# EAGLE design Itsy Bitsy 32u4 5V (EAGLE 6.4)
COMPANY: ADAFRUIT INDUSTRIES; DRAWN: KTOWN; REV: B
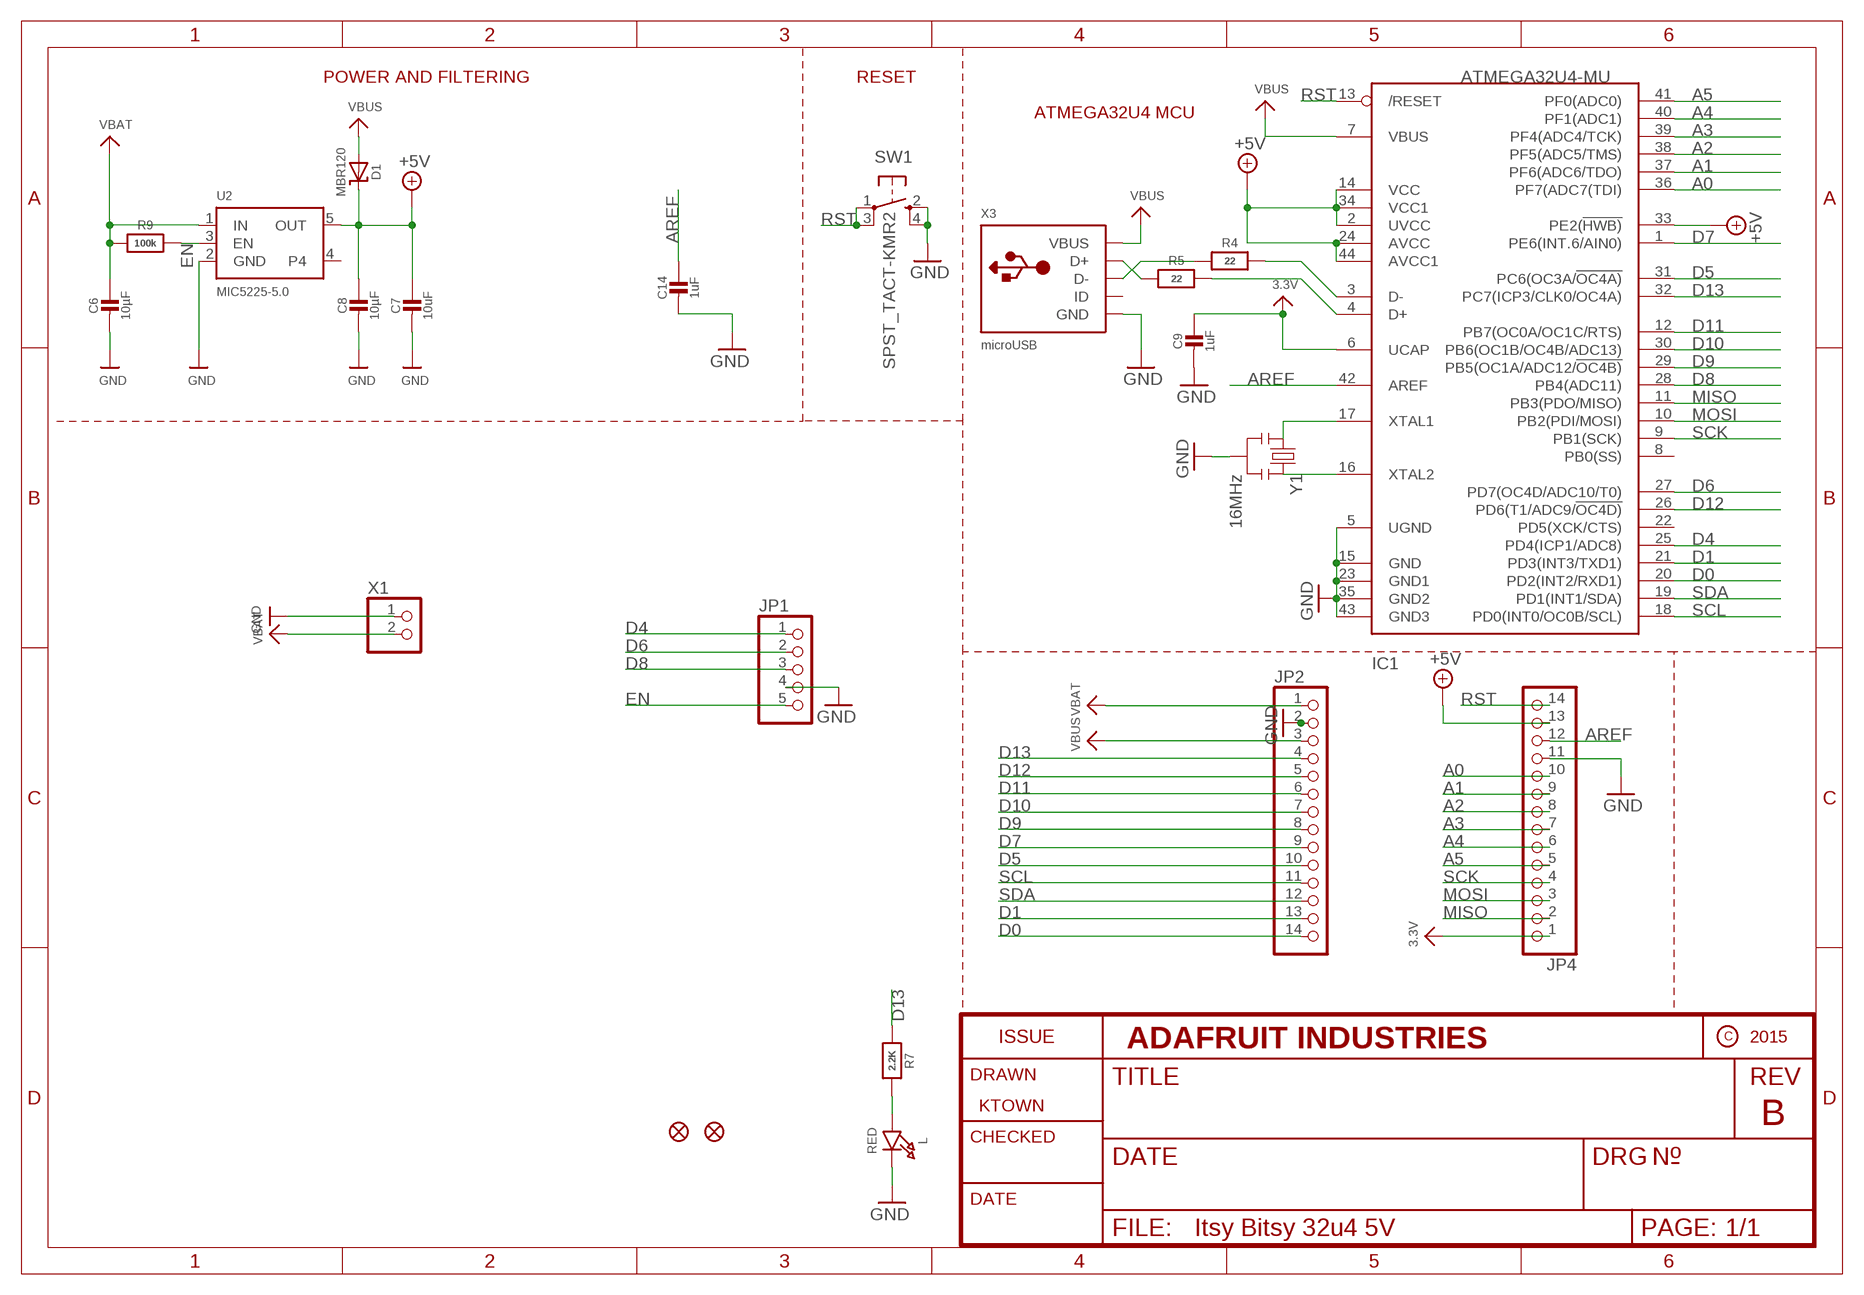
[diagram p0: schematic, sheet 1]

## Parts
C6  10µF  CAP_CERAMIC0805-NOOUTLINE  [0805-NO]
C7  10uF  CAP_CERAMIC0805-NOOUTLINE  [0805-NO]
C8  10µF  CAP_CERAMIC0805-NOOUTLINE  [0805-NO]
C9  1uF  CAP_CERAMIC0603_NO  [0603-NO]
C14  1uF  CAP_CERAMIC0603_NO  [0603-NO]
D1  MBR120  DIODE-SCHOTTKYSOD-123  [SOD-123]
IC1  ATMEGA32U4-MU  [TQFN44_7MM]
JP1  HEADER-1X5ROUND  [1X05_ROUND]
JP2  HEADER-1X14  [1X14_ROUND70]
JP4  HEADER-1X14  [1X14_ROUND70]
L  RED  LED0805_NOOUTLINE  [CHIPLED_0805_NOOUTLINE]
R4  22  RESISTOR_0603_NOOUT  [0603-NO]
R5  22  RESISTOR_0603_NOOUT  [0603-NO]
R7  2.2K  RESISTOR_0603_NOOUT  [0603-NO]
R9  100k  RESISTOR_0603_NOOUT  [0603-NO]
SW1  SPST_TACT-KMR2  [KMR2]
U2  MIC5225-5.0  VREG_SOT23-5  [SOT23-5]
U$34  FIDUCIAL""  [FIDUCIAL_1MM]
U$35  FIDUCIAL""  [FIDUCIAL_1MM]
X1  CON_JST_PH_2PIN  [JSTPH2]
X3  microUSB  USB_MICRO_20329_V2  [4UCONN_20329_V2]
Y1  16MHz  RESONATORSMD  [RESONATOR-SMD]

## Nets
3.3V: C9.1 IC1.6(UCAP) JP4.1
+5V: C7.1 C8.1 D1.C IC1.2(UVCC) IC1.14(VCC) IC1.24(AVCC) IC1.33(PE2(!HWB)) IC1.34(VCC1) IC1.44(AVCC1) JP4.13 U2.5(OUT)
A0: IC1.36(PF7(ADC7(TDI)) JP4.10
A1: IC1.37(PF6(ADC6/TDO)) JP4.9
A2: IC1.38(PF5(ADC5/TMS)) JP4.8
A3: IC1.39(PF4(ADC4/TCK)) JP4.7
A4: IC1.40(PF1(ADC1)) JP4.6
A5: IC1.41(PF0(ADC0)) JP4.5
AREF: C14.1 IC1.42(AREF) JP4.12
D0: IC1.20(PD2(INT2/RXD1)) JP2.14
D1: IC1.21(PD3(INT3/TXD1)) JP2.13
D4: IC1.25(PD4(ICP1/ADC8)) JP1.1
D5: IC1.31(PC6(OC3A/!OC4A)) JP2.10
D6: IC1.27(PD7(OC4D/ADC10/T0)) JP1.2
D7: IC1.1(PE6(INT.6/AIN0)) JP2.9
D8: IC1.28(PB4(ADC11)) JP1.3
D9: IC1.29(PB5(OC1A/ADC12/!OC4B)) JP2.8
D10: IC1.30(PB6(OC1B/OC4B/ADC13)) JP2.7
D11: IC1.12(PB7(OC0A/OC1C/RTS)) JP2.6
D12: IC1.26(PD6(T1/ADC9/!OC4D)) JP2.5
D13: IC1.32(PC7(ICP3/CLK0/OC4A)) JP2.4 R7.1
D+: IC1.4(D+) R5.2
D-: IC1.3(D-) R4.2
EN: JP1.5 R9.2 U2.3(EN)
GND: C6.2 C7.2 C8.2 C9.2 C14.2 IC1.5(UGND) IC1.15(GND) IC1.23(GND1) IC1.35(GND2) IC1.43(GND3) JP1.4 JP2.2 JP4.11 L.C SW1.2(S) SW1.4(S1) U2.2(GND) X1.1 X3.BASE@1(GND) X3.BASE@2(GND) X3.GND X3.SPRT@1(GND) X3.SPRT@2(GND) X3.SPRT@3(GND) X3.SPRT@4(GND) Y1.2
MISO: IC1.11(PB3(PDO/MISO)) JP4.2
MOSI: IC1.10(PB2(PDI/MOSI)) JP4.3
N$2: L.A R7.2
N$11: IC1.16(XTAL2) Y1.3
N$12: IC1.17(XTAL1) Y1.1
N$15: R5.1 X3.D+
N$16: R4.1 X3.D-
RST: IC1.13(/RESET) JP4.14 SW1.1(P) SW1.3(P1)
SCK: IC1.9(PB1(SCK)) JP4.4
SCL: IC1.18(PD0(INT0/OC0B/SCL)) JP2.11
SDA: IC1.19(PD1(INT1/SDA)) JP2.12
VBAT: C6.1 JP2.1 R9.1 U2.1(IN) X1.2
VBUS: D1.A IC1.7(VBUS) JP2.3 X3.VBUS
Unconnected: IC1.8(PB0(SS)) IC1.22(PD5(XCK/CTS)) U2.4 X3.ID

## Notes on the sheet
- POWER AND FILTERING | RESET
- ATMEGA32U4 MCU

## Library data of the parts
C6-C9 C14 = microbuilder:CAP_CERAMIC: Ceramic Capacitors For new designs, use the packages preceded by an '_' character since they are more reliable: The following footprints should be used on most boards: _0402 - Standard footprint for regular board layouts _0603 - Standard footprint for regular board layouts _0805 - Standard footprint for regular board layouts _1206 - Standard footprint for regular board layouts For extremely tight-pitch boards where space is at a premium, the following 'micro-pitch' footprints can be used (smaller pads, no silkscreen outline, etc.): _0402MP - Micro-pitch footprint for very dense/compact boards _0603MP - Micro-pitch footprint for very dense/compact boards _0805MP - Micro-pitch footprint for very dense/compact boards _1206MP - Micro-pitch footprint for very dense/compact boards
D1 = microbuilder:DIODE-SCHOTTKY
IC1 = microbuilder:ATMEGA32U4: http://www.ladyada.net/library/eagle
JP1 = microbuilder:HEADER-1X5: PIN HEADER
JP2 JP4 = microbuilder:HEADER-1X14
L = microbuilder:LED: LED 0603 - 0603 Surface Mount Package 2mA: Green LED - Low Power (3.9mcd, 2ma, 1.7Vf) - Digikey: 475-2709-2-ND Orange LED - Low Power (9.8mcd, 2ma, 1.8Vf) - Digikey: 475-1194-2-ND Red LED - Low Power (5mcd, 2ma, 1.8Vf) - Digikey: 475-1195-2-ND Yellow LED - Low Power (7mcd, 2ma, 1.8Vf) - Digikey: 475-1196-2-ND 5mA: Blue LED - Low Power (17mcd, 5ma, 2.9Vf) - Digikey: LNJ937W8CRACT-ND 0805 - 0805 Surface Mount Package 2mA: Red LED (8.8mcd, 2mA, 1.8Vf, Clear) - Low Power [Digikey: 475-2510-1-ND] Green LED (5mcd, 2mA, 1.8Vf, Clear) - Low Power [Digikey: 475-2730-1-ND] Yellow LED (11.3mcd, 2mA, 1.8Vf, Clear) - Low Power [Digikey: 475-2555-1-ND] 20mA: Red LED (104mcd, 20mA, Diffused) - LS R976 [Digikey: 475-1278-6-ND] Red LED (12mcd, 20mA, 2.0Vf, Clear) - APT2012EC [Digikey: 754-1128-1-ND] Green LED (15mcd, 20mA, 2.2Vf, Clear) - APT2012GC [Digikey: 754-1131-1-ND] Orange LED (160mcd, 20mA, 2.1Vf, Clear) - APT2012SECK [Digikey: 754-1130-1-ND] 1206 - 1206 Surface Mount Package Green LED (26mcd, 20mA, Diffused) - LG N971 [Digikey: 475-1407-6-ND] Red LED (15mcd, 20mA, Diffused) - LH N974 [Digikey: 475-1416-6-ND] Cree - Cree High-Power Surface Mount LEDs XPEBWT-L1-0000-00D50 - White 111lm 350mA 2.9Vf 6200K 110° XTEAWT-00-0000-00000LEE3 - White 114lm 350mA 2.85Vf 5000K 115° Everlight - Everlight 45-21 Series Surface Mount LEDs 45-21/QK2C-B2832AC2CB2/2T - Warm White 2000mcd 20mA 3.25Vf 3050K 120° 45-21/LK2C-B38452C4CB2/2T - Nuetral White 2000mcd 20mA 3.25Vf 4150K 120° 45-21/LK2C-B50634C6CB2/2T - Cold White 2200mcd 20mA 3.25Vf 5650K 120° PLCC2 Reverse Mount LS T77K-J1L2-1-0-2-R18-Z - Red 11.25mcd 2mA 1.8Vf 630nm 120° LO T77K-L1M2-24-Z - Orange 19.6mcd 2mA 1.8Vf 606nm 120° LY T77K-K2M1-26-Z - Yellow 15.7mcd 2mA 1.8Vf 587nm 120°
R4 R5 R7 R9 = microbuilder:RESISTOR: Resistors For new designs, use the packages preceded by an '_' character since they are more reliable: The following footprints should be used on most boards: _0402 - Standard footprint for regular board layouts _0603 - Standard footprint for regular board layouts _0805 - Standard footprint for regular board layouts _1206 - Standard footprint for regular board layouts For extremely tight-pitch boards where space is at a premium, the following 'micro-pitch' footprints can be used (smaller pads, no silkscreen outline, etc.): _0402MP - Micro-pitch footprint for very dense/compact boards _0603MP - Micro-pitch footprint for very dense/compact boards _0805MP - Micro-pitch footprint for very dense/compact boards _1206MP - Micro-pitch footprint for very dense/compact boards
SW1 = adafruit:SPST_TACT: SMT 6mm switch, EVQQ2 series http://www.ladyada.net/library/eagle
U2 = microbuilder:VREG_SOT23-5: SOT23-5 Fixed Voltage Regulators Part Current Out V Out V In V Dropout θJA (°C/W) TJ (°C) Digikey Part No. ADP121 150mA 3.3V 3.4-5.5V 0.09V @ 150mA -- -- ADP121-AUJZ33R7CT-ND ADP121 150mA 3.0V 3.1-5.5V 0.09V @ 150mA -- -- ADP121-AUJZ30R7CT-ND ADP122 300mA 3.3V 3.4-5.5V 0.085V @ 300mA -- -- ADP122AUJZ-3.3-R7CT-ND ADP1712 300mA 3.3V 3.5-5.5V 0.17V @ 300mA -- -- ADP1712AUJZ-3.3-R7TR-ND AP7311 (Low Cost) 150mA 3.3V 3.5-6V 0.15V @ 150mA -- -- AP7311-33WG-7DICT-ND LD39015M18R 150mA 1.8V 1.9V-5.5V 0.08V @ 100mA -- -- 497-6977-1-ND LP2985A-33DBVR 150mA 3.3V 3.3-16V 0.28V @ 150mA 206 150 296-18479-1-ND MCP1824T-3302E/OT 300mA 3.3V 3.5V-6V 0.2V @ 300mA -- -- MCP1824T-3302E/OTCT-ND MIC5205-2.5YM5 TR 150mA 2.5V 2.7-16V 0.165V @ 150mA -- -- 576-1257-2-ND MIC5205-3.0YM5 TR 150mA 3.0V 3.2V-16V 0.165V @ 150mA -- -- 576-1258-2-ND MIC5205-3.3YM5 TR 150mA 3.3V 3.5V-16V 0.165V @ 150mA -- -- 576-1259-2-ND TPS780330220 150mA 3.3V+2.2V 3.6-5.5V 250mV Max -- -- 296-23332-1-ND TDA3663/N1,135 100mA 3.3V 3.5-45V 0.18V @ 50mA -- -- 568-5343-1-ND Max operating temp can be calculated using θJA, TJ (max junction temperature), and power in watts. Set the "Maximum Ambient Temperature" until it reaches TJ ("Max Junction Temperature"), which is the absolute limit for safe use of the regulator: Heat Sink Temperature Calculator <http://www.daycounter.com/Calculators/Heat-Sink-Temperature-Calculator.phtml> For example, With 12V source into a 3.3V LP2985 and a 30mA load, we are dissipating (12V-3.3V) * 0.03A = 0.261W. With a θJA of 206 °C/W, a TJ of 150°C, and 261mW we can safely use the chip without a heat sink up to 75°C (=147.1°C Junction Temperature).
U$34 U$35 = microbuilder:FIDUCIAL: Fiducial Alignment Points Various fiducial points for machine vision alignment.; BOM: EXCLUDE
X1 = microbuilder:CON_JST_PH_2PIN: JST 2-Pin Right-Angle Connector PH-Series - 4UConnector: 17311 SH-Series - 4UConnector: 07278
X3 = microbuilder:USB: USB Connectors USBMINIB - Surface Mount Female Mini-B USB Connector 4UConnector: 06564
Y1 = SparkFun:RESONATOR: Resonator Small SMD resonator. This is the itty bitty 10/20MHz resonators with built in caps. CSTCE10M0G55 and CSTCE20M0V53. Footprint has been reviewed closely but hasn't been tested yet.

## Board
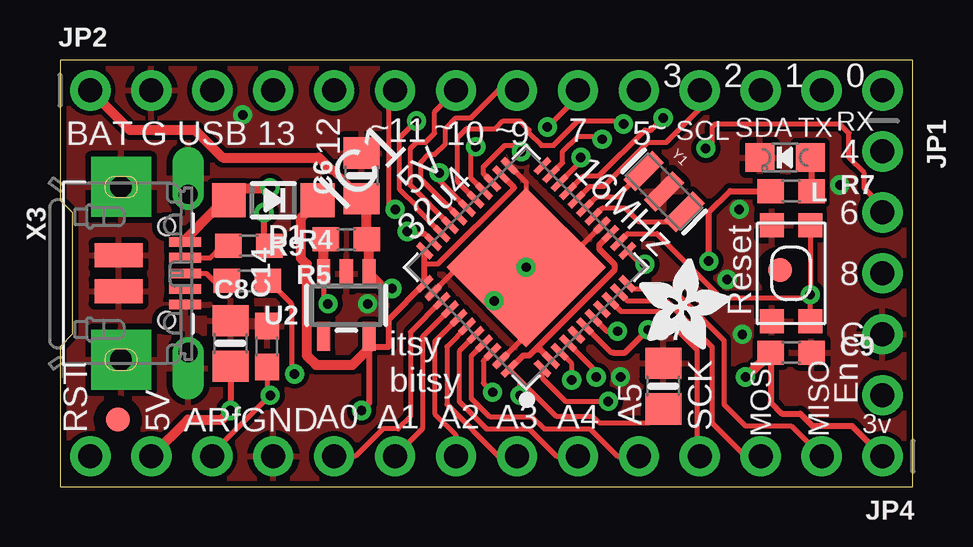
[diagram p1: board, top side]
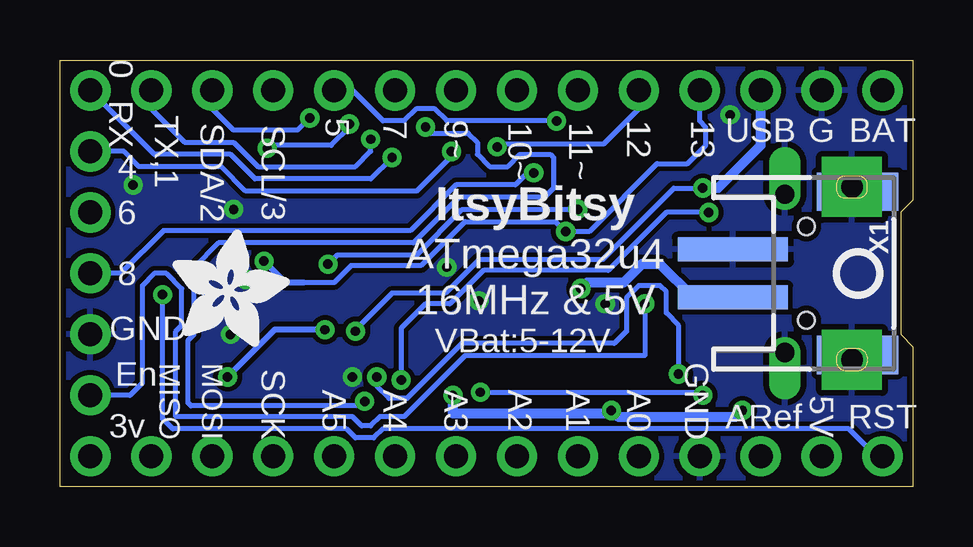
[diagram p2: board, bottom side, seen from below]

Size 35.56 x 17.78 mm. Coordinates in mm from the lower left corner, seen from the top.
Outline: 0,5.84 0,0 35.56,0 35.56,17.78 0,17.78 0,11.94 0.51,11.43 0.51,6.35 0,5.84
Copper layers (1*16): Top 0.035mm / dielectric 1.5mm / Bottom 0.035mm
Design rules "adafruit *": minimum track width 8mil, minimum drill 15.5mil, track to track 8mil, track to pad 8mil, pad to pad 8mil, via to via 8mil, smd to smd 8mil, copper to edge 10mil, drill to drill 8mil, minimum pad ring 10mil, minimum via ring 8mil, stop-mask expansion 2mil, vias tented up to drill 20mil, thermal gap 10mil

### Footprints (pad centres in the part's own frame; a part is rotated, then mirrored left to right if it is on the bottom)
0805-NO = smd 1.3 x 1.5: 1 -0.95,0; 2 0.95,0
0603-NO = smd 1.1 x 1: 1 -0.85,0; 2 0.85,0
SOD-123 = smd 1.4 x 1.4: A 1.85,0; C -1.85,0
TQFN44_7MM = smd 0.25 x 0.8: 1 -2.5,-3.475; 2 -2,-3.475; 3 -1.5,-3.475; 4 -1,-3.475; 5 -0.5,-3.475; 6 0,-3.475; 7 0.5,-3.475; 8 1,-3.475; 9 1.5,-3.475; 10 2,-3.475; 11 2.5,-3.475; 23 2.5,3.475; 24 2,3.475; 25 1.5,3.475; 26 1,3.475; 27 0.5,3.475; 28 0,3.475; 29 -0.5,3.475; 30 -1,3.475; 31 -1.5,3.475; 32 -2,3.475; 33 -2.5,3.475 | smd 0.8 x 0.25: 12 3.475,-2.5; 13 3.475,-2; 14 3.475,-1.5; 15 3.475,-1; 16 3.475,-0.5; 17 3.475,0; 18 3.475,0.5; 19 3.475,1; 20 3.475,1.5; 21 3.475,2; 22 3.475,2.5; 34 -3.475,2.5; 35 -3.475,2; 36 -3.475,1.5; 37 -3.475,1; 38 -3.475,0.5; 39 -3.475,0; 40 -3.475,-0.5; 41 -3.475,-1; 42 -3.475,-1.5; 43 -3.475,-2; 44 -3.475,-2.5 | smd 4.7 x 4.7: THERMAL 0,0
1X05_ROUND = drill 1 pad 1.676: 1 -5.08,0; 2 -2.54,0; 3 0,0; 4 2.54,0; 5 5.08,0
1X14_ROUND70 = drill 1 pad 1.676: 1 -16.51,0; 2 -13.97,0; 3 -11.43,0; 4 -8.89,0; 5 -6.35,0; 6 -3.81,0; 7 -1.27,0; 8 1.27,0; 9 3.81,0; 10 6.35,0; 11 8.89,0; 12 11.43,0; 13 13.97,0; 14 16.51,0
CHIPLED_0805_NOOUTLINE = smd 1.2 x 1.2: A 0,-1.05; C 0,1.05
KMR2 = smd 1 x 1: 1 2,0.8; 2 2,-0.8; 3 -2,0.8; 4 -2,-0.8
SOT23-5 = smd 0.55 x 1.2: 1 -0.95,-1.3; 2 0,-1.3; 3 0.95,-1.3; 4 0.95,1.3; 5 -0.95,1.3
FIDUCIAL_1MM = smd 1 x 1: 1 0,0
JSTPH2 = smd 1 x 4.6: 1 -1,-3.7; 2 1,-3.7 | smd 1.6 x 3.4: NC1 -3.4,1.5; NC2 3.4,1.5
4UCONN_20329_V2 = smd 1 x 2: BASE@1 -0.75,-2; BASE@2 0.75,-2 | smd 0.4 x 1.35: D+ 0,0.775; D- -0.65,0.775; GND 1.3,0.775; ID 0.65,0.775; VBUS -1.3,0.775 | drill 0.8 pad 1.2 offset: SPRT@1 -3.3,0.9; SPRT@2 3.3,0.9 | drill 0.9 pad 2.5 square: SPRT@3 -3.6,-1.9; SPRT@4 3.6,-1.9 | hole 0.7: -1.95,0; 1.95,0
RESONATOR-SMD = smd 0.7 x 1.7: 1 -1.2,0; 2 0,0; 3 1.2,0

### Placement (x,y rotation side)
C6  12.57,12.95 90 top
C7  25.15,4.19 90 top
C8  7.11,5.97 90 top
C9  30.48,5.59 0 top
C14  8.64,5.84 90 top
D1  8.89,11.94 180 top
IC1  19.43,9.14 45 top
JP1  34.29,8.89 270 top
JP2  17.78,16.51 0 top
JP4  17.78,1.27 180 top
L  30.23,13.72 90 top
R4  7.87,10.03 0 top
R5  7.81,8.57 0 top
R7  30.48,12.32 0 top
R9  11.94,10.31 180 top
SW1  30.48,8.89 270 top
U2  11.94,7.57 180 top
U$4  [ADAFRUIT_5MM]  30.86,5.84 0 bottom
U$7  [ADAFRUIT_3.5MM]  24.13,5.71 0 top
U$10  [PCBFEAT-REV-040]  2.29,8.89 0 bottom
U$34  2.41,2.79 270 top
U$35  30.02,9.02 270 top
X1  3.81,8.89 270 bottom
X3  4.45,8.89 270 top
Y1  25.18,12.3 315 top

### Tracks (layer width: path | path; a pad name or v marks a point on that pad's centre or on a via)
3.3V  (via drill 0.39)
  Top 0.203: IC1.6 22.99,5.59 23.07,5.59
  Top 0.254: 23.07,5.59 23.56,5.59 v24.51,6.54 | C9.1 29.63,3.52 30.1,3.05 30.86,3.05 31.37,2.54 33.02,2.54 JP4.1
  Top 0.406: C9.1 28.61,4.57 v28.57,4.57
  Bottom 0.254: v24.51,6.54 26.61,6.54 v28.57,4.57
+5V  (via drill 0.39)
  Top 0.203: 19.18,4.45 20.7,2.92 22.23,2.92 22.48,2.67 24.57,2.67 C7.1 | 19.18,4.45 18.74,4.88 | v19.18,3.81 19.18,4.45 | 18.92,12.45 15.75,9.27 15.21,9.27
  Top 0.254: IC1.33 15.21,9.27 15.21,8.47 | 15.21,8.47 IC1.34 | IC1.24 18.92,12.48 18.92,12.45 | v12.57,3.17 12.89,3.49 U2.5 13.02,6.27 13.02,5.84 13.72,5.84 13.72,6.99 15.21,8.47 | C8.1 v7.11,3.17 | 18.74,4.88 IC1.44 18.76,4.92 19.3,5.46 19.56,5.46 19.81,5.71 | IC1.2 20.03,5.71 19.81,5.71 | IC1.14 22.48,10.07 22.48,9.91 23.11,9.27 23.11,9.02 19.81,5.71
  Top 0.406: JP4.13 5.33,2.79 6.73,2.79 v7.11,3.17 | D1.C 10.74,11.88 10.03,11.18 10.03,9.53 10.29,9.27 10.29,5.46 10.67,5.08 12.19,5.08 12.89,5.78 U2.5
  Bottom 0.406: v12.57,3.17 12.45,3.05 | 12.45,3.05 12.32,2.92 7.37,2.92 v7.11,3.17 | 12.45,3.05 19.18,3.05 v19.18,3.81
A0
  Top 0.203: IC1.36 14.61,6.44 14.61,2.92 14.1,2.41 13.46,2.41 12.32,1.27 JP4.10
A1
  Top 0.203: IC1.37 15.11,6.24 15.11,2.41 JP4.9
A2
  Top 0.203: JP4.8 16.51,2.16 15.62,3.05 15.62,6.04 IC1.38
A3
  Top 0.203: JP4.7 18.29,1.27 16.13,3.43 16.13,5.84 IC1.39
A4
  Top 0.203: IC1.40 16.64,5.64 16.64,3.56 17.78,2.41 19.56,2.41 20.7,1.27 JP4.6
A5
  Top 0.203: IC1.41 17.14,5.44 17.14,3.68 17.91,2.92 19.68,2.92 20.19,2.41 22.1,2.41 23.24,1.27 JP4.5
AREF  (via drill 0.39)
  Top 0.203: IC1.42 17.65,5.25 17.65,4.32 v18.03,3.94 | JP4.12 6.35,1.4 v8.76,3.81 8.64,3.94 C14.1
  Bottom 0.203: v18.03,3.94 8.89,3.94 v8.76,3.81
D0  (via drill 0.39)
  Top 0.203: IC1.20 21.72,13.55 v21.72,13.72
  Bottom 0.203: JP2.14 31.62,13.84 28.45,13.84 27.43,12.83 22.61,12.83 v21.72,13.72
D1  (via drill 0.39)
  Top 0.203: IC1.21 20.95,13.5 20.95,13.97 21.59,14.61 22.61,14.61 v22.61,14.48
  Bottom 0.203: JP2.13 31.75,15.75 30.35,14.35 28.32,14.35 27.3,13.34 23.24,13.34 22.61,13.97 v22.61,14.48
D4  (via drill 0.39)
  Top 0.203: IC1.25 17.65,13.04 17.65,13.34 18.54,14.22 18.99,14.22 v19.24,13.97
  Bottom 0.203: JP1.1 32.89,13.97 32.26,13.34 28.83,13.34 27.81,12.32 20.7,12.32 19.24,13.78 v19.24,13.97
D5  (via drill 0.39)
  Top 0.203: IC1.31 14.86,11.6 14.86,11.68 14.16,12.38 14.16,14.54 v14.86,15.24
  Bottom 0.203: v14.86,15.24 19.43,15.24 19.94,15.75 20.7,15.75 21.21,15.24 22.1,15.24 23.37,16.51
  Bottom 0.254: 23.37,16.51 JP2.10
D6  (via drill 0.39)
  Top 0.203: IC1.27 16.57,12.71 16.57,14.54 16.95,14.92 18.16,14.92 18.48,15.24 19.18,15.24 19.56,14.86 19.56,14.73 20.07,14.22 20.57,14.22 21.59,15.24 23.37,15.24 v23.5,15.11 | v26.92,14.1 27.18,14.35 27.18,14.99 27.3,15.11 32.51,15.11 32.89,14.73 32.89,13.72 33.53,13.08 33.53,12.45 34.29,11.68 JP1.2
  Bottom 0.203: v23.5,15.11 23.5,14.99 24.26,14.22 26.8,14.22 | 26.8,14.22 26.92,14.22 | v26.92,14.1 26.8,14.22
D7  (via drill 0.39)
  Top 0.203: v22.86,3.56 21.08,3.56 20.12,4.52 IC1.1 | JP2.9 21.59,16.13 21.46,16.13 v20.32,14.99
  Bottom 0.203: v20.32,14.99 20.32,14.86 20.19,14.73 18.54,14.73 18.16,14.35 18.16,13.84 17.65,13.34 16.89,13.34 16.38,13.84 15.11,13.84 14.99,13.72 14.99,12.45 15.37,12.06 18.92,12.06 20.83,10.16 28.96,10.16 29.97,9.14 29.97,6.35 30.23,6.1 30.23,3.49 30.1,3.37 23.05,3.37 v22.86,3.56
D8  (via drill 0.39)
  Top 0.203: IC1.28 15.81,12.76 v15.81,13.08
  Bottom 0.203: v15.81,13.08 16.07,13.08 16.57,12.57 19.05,12.57 20.95,10.67 31.24,10.67 33.02,8.89 JP1.3
D9
  Top 0.203: JP2.8 18.29,16.51 17.14,15.37 16.51,15.37 16.07,14.92 16.07,14.29 15.62,13.84 15.37,13.84 15.05,13.53 15.05,12.82 IC1.29
D10
  Top 0.203: JP2.7 15.62,15.62 15.62,14.73 15.24,14.35 14.86,14.35 14.61,14.1 14.61,12.56 IC1.30
D11  (via drill 0.39)
  Top 0.203: IC1.12 24.22,9.27 v24.38,9.27 | v13.97,11.56 13.72,11.81 13.72,16.26 JP2.6
  Bottom 0.203: v24.38,9.27 24,9.65 20.7,9.65 18.8,11.56 v13.97,11.56
D12  (via drill 0.39)
  Top 0.203: IC1.26 17.14,12.84 17.14,13.97 v17.34,14.16
  Bottom 0.203: v17.34,14.16 17.21,14.29 12.89,14.29 11.43,15.75 JP2.5 11.43,16.38
D13  (via drill 0.39)
  Top 0.203: IC1.32 15.21,10.54 14.57,10.54 v14.48,10.63
  Top 0.254: v27.05,9.4 27.05,11.43 27.94,12.32 R7.1
  Bottom 0.203: JP2.4 8.89,15.24 8.64,14.99 8.64,14.22 9.4,13.46 10.67,13.46 13.5,10.63 v14.48,10.63 14.89,11.05 18.67,11.05 20.51,9.21 23.43,9.21 24.13,8.51 25.4,8.51
  Bottom 0.254: 25.4,8.51 26.16,8.51 v27.05,9.4
D+  (via drill 0.39)
  Top 0.203: IC1.4 22.35,4.81 v22.35,4.57 | v9.78,4.7 9.65,4.83 9.65,7.62 8.7,8.57 R5.2
  Bottom 0.203: v22.35,4.57 22.35,4.19 21.84,3.68 21.08,3.68 18.8,5.97 12.45,5.97 11.94,6.48 11.94,7.87 11.43,8.38 10.54,8.38 10.29,8.13 10.29,7.24 9.78,6.73 v9.78,4.7
D-  (via drill 0.39)
  Top 0.203: v21.34,4.45 21.34,5.12 IC1.3 | 8.51,10.29 8.72,10.07 R4.2
  Top 0.254: 8.51,10.29 v8.51,11.43
  Bottom 0.203: v8.51,11.43 10.29,11.43 12.7,9.02 17.91,9.02 19.3,7.62 20.32,7.62 21.34,6.6 v21.34,4.45
EN  (via drill 0.39)
  Top 0.203: U2.3 10.99,7.81 v11.18,7.62
  Top 0.406: U2.3 10.99,10.09 R9.2
  Bottom 0.203: v11.18,7.62 11.18,5.46 18.67,5.46 21.21,2.92 22.23,2.92 22.61,2.54 22.99,2.54 23.37,2.92 30.73,2.92 30.73,6.48 30.48,6.73 30.48,8.26 31.11,8.89 31.62,8.89 32.13,8.38 32.13,4.32 32.64,3.81 JP1.5
GND  (via drill 0.39)
  Top 0.203: IC1.43 19.43,6.32 | IC1.35 16.6,9.14 v19.43,9.14 | IC1.23 19.43,12.68 v19.43,9.14 | IC1.15 20.84,9.14 v19.43,9.14 | v18.1,7.75 19.43,9.08 v19.43,9.14
  other vias: 12.83,7.62 7.62,15.49 28.32,11.56 27.81,8.64 28.45,6.35 23.37,4.57 32.51,12.57
  pour Top: 0,17.78 0,0 35.56,0 35.56,17.78
  pour Bottom: 0,0 35.56,0.13 35.56,17.78 0,17.78
MISO
  Top 0.203: IC1.11 23.86,8.26 25.53,8.26 27.69,6.1 27.69,3.43 28.57,2.54 30.48,2.54 JP4.2
MOSI
  Top 0.203: IC1.10 23.66,7.75 25.27,7.75 27.18,5.84 27.18,2.67 28.57,1.27 JP4.3
N$2
  Top 0.254: L.A 31.33,13.66 R7.2
N$11
  Top 0.203: IC1.16 22.61,11.62 23.56,11.62 24.13,11.05 25.63,11.05 Y1.3
N$12
  Top 0.203: IC1.17 22.36,12.07 23.25,12.07 Y1.1
N$15
  Top 0.203: X3.D+ 6.1,8.89 6.41,8.57 R5.1
N$16
  Top 0.203: X3.D- 6.28,9.54 6.77,10.03 R4.1
RST  (via drill 0.39)
  Top 0.203: SW1.3 v31.28,8 | IC1.13 23.66,10.54 24.89,10.54 27.56,7.87 31.24,7.87 31.28,7.91 v31.28,8 | 31.28,6.64 SW1.1 v31.28,8
  Bottom 0.203: JP4.14 1.52,1.27 2.67,2.41 22.1,2.41 22.48,2.03 23.24,2.03 23.62,2.41 30.86,2.41 31.28,2.83 v31.28,8
SCK
  Top 0.203: IC1.9 23.39,7.3 24.96,7.3 26.54,5.71 26.54,1.4 JP4.4
SCL
  Top 0.203: IC1.18 22.09,12.51 22.67,12.51 24.51,14.35 25.27,14.35 26.67,15.75 JP2.11
SDA  (via drill 0.39)
  Top 0.203: 24.77,14.99 v25.15,15.37 24.64,14.86 24.38,14.86 22.48,12.95 21.83,12.95 IC1.19
  Bottom 0.203: JP2.12 29.21,15.75 28.32,14.86 25.65,14.86 v25.15,15.37
VBAT  (via drill 0.39)
  Top 0.203: C6.1 12.57,11.88 12.79,11.66
  Top 0.254: 11.3,13.21 11.56,12.95 11.68,12.95 12.63,12 C6.1
  Top 0.406: JP2.1 2.92,14.86 5.64,14.86 6.79,13.72 10.79,13.72 11.3,13.21 | 12.79,11.66 R9.1 12.89,10.09 U2.1 13.5,8.26 v13.84,8.26
  Bottom 0.406: X1.2 9.16,7.89 10.54,9.27 11.3,9.27 12.06,8.51 13.59,8.51 v13.84,8.26
VBUS  (via drill 0.39)
  Top 0.203: IC1.7 22.8,6.48 v23.24,6.48
  Top 0.406: X3.VBUS 5.22,10.3 6.48,11.56 6.66,11.56 D1.A 7.55,12.45 v8.76,12.45
  Bottom 0.203: v23.24,6.48 23.24,6.54 21.72,8.06 19.49,8.06 18.1,9.46 12.95,9.46 9.97,12.45 v8.76,12.45
  Bottom 0.406: JP2.3 6.35,14.22 8.13,12.45 v8.76,12.45

### Text on the board
tPlace: 3 | 2 | 1 | 0 | BAT | G | USB | 13 | 12 | ~ | 11 | ~ | 10 | ~ | 9 | 7 | 5 | ~ | SCL | SDA | TX | RX | 16MHz | 4 | 5V | 6 | 32u4 | Reset | 8 | G | RST | itsy / bitsy | SCK | MOSI | MISO | 5V | ARf | GND | A0 | A1 | A2 | A3 | A4 | A5 | En | 3v
bPlace: 0 | BAT | G | USB | 7 | 5 | RX | 13 | 12 | 11~ | 10~ | 9~ | TX,1 | SCL/3 | SDA/2 | 4 | ItsyBitsy | 6 | ATmega32u4 / 16MHz & 5V | 8 | GND | VBat:5-12V | En | GND | MOSI | MISO | RST | 5V | ARef | A0 | A1 | A2 | A3 | A4 | A5 | SCK | 3v